# Altium schematic sheet A2_1_G.SchDoc
size 594 x 421 mm; SheetNumber: №; SheetTotal: №№; ESKD_Oformil: ФИО; ESKD_Proveril: ФИО; ESKD_DIVG: ДИВГ.хххххх.ххх Э3; ESKD_Razrabotal: ФИО; ESKD_utverdil: Гондуров С.А.; ESKD_NachOET: Нач. ОЭТ; ESKD_NachOET_FIO: Ефименко А.В.; ESKD_DIVG_SP: ДИВГ.хххххх.ххх; ESKD_NK_FIO: Козлова Г.В.
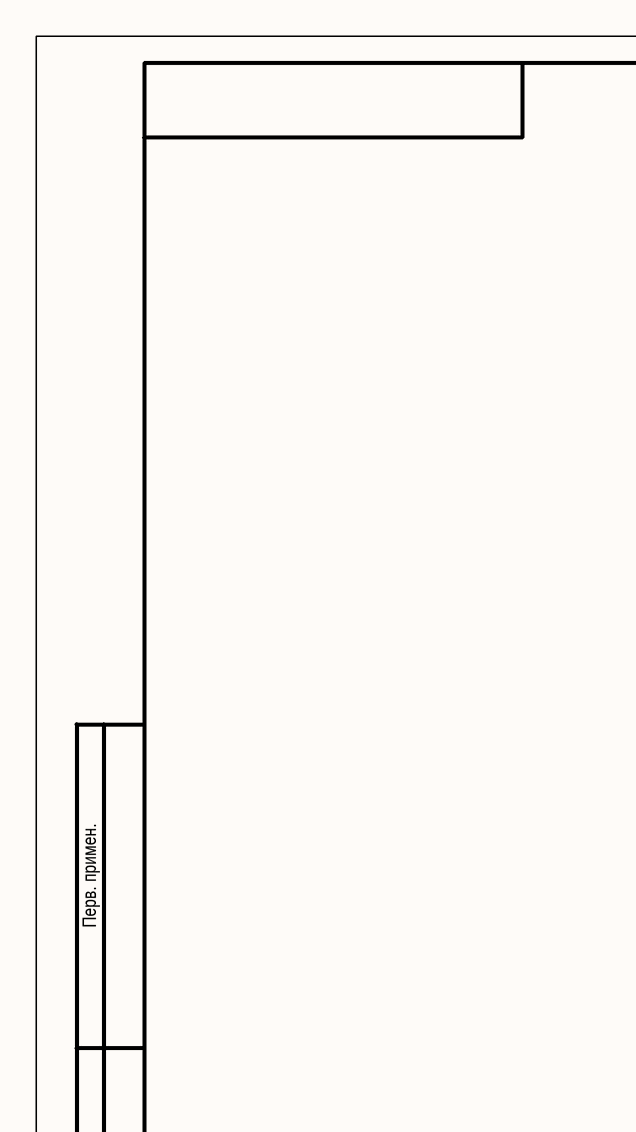
[diagram p0: A2_1_G.SchDoc, top left]
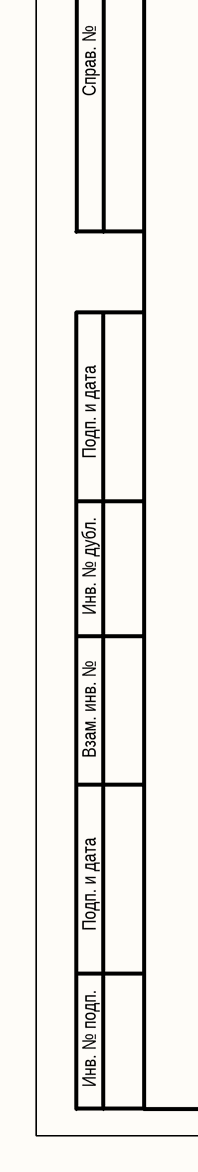
[diagram p1: A2_1_G.SchDoc, bottom left]
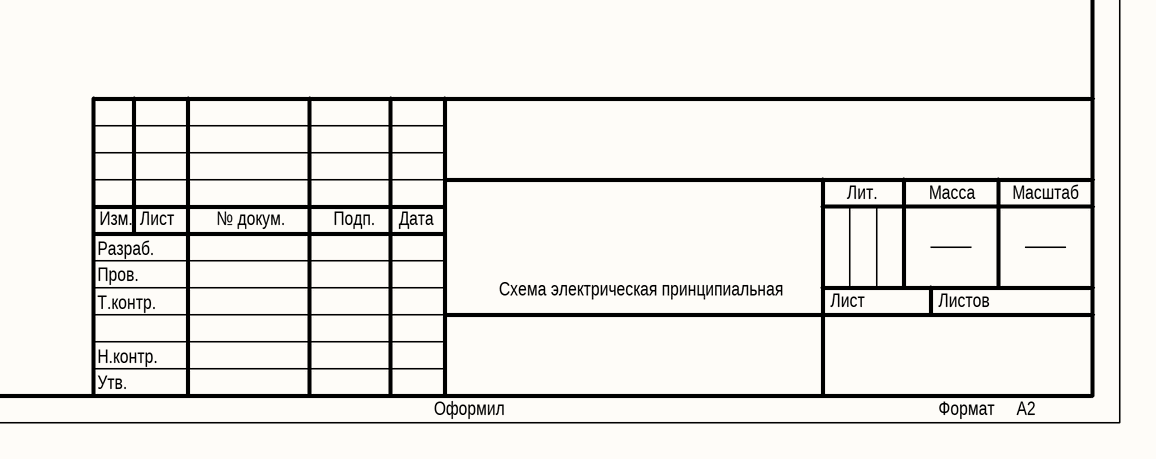
[diagram p2: A2_1_G.SchDoc, bottom right]

## Notes on the sheet
- Перв. примен.
- Справ. №
- Подп. и дата
- Инв. № дубл.
- Взам. инв. №
- Изм.
- Лист
- № докум.
- Подп.
- Дата
- Лит.
- Масса
- Масштаб
- Разраб.
- Пров.
- Т.контр.
- Схема электрическая принципиальная
- Листов
- Инв. № подп.
- Н.контр.
- Утв.
- Оформил
- Формат     А2